# Altium schematic sheet Regulators.SchDoc
size A4
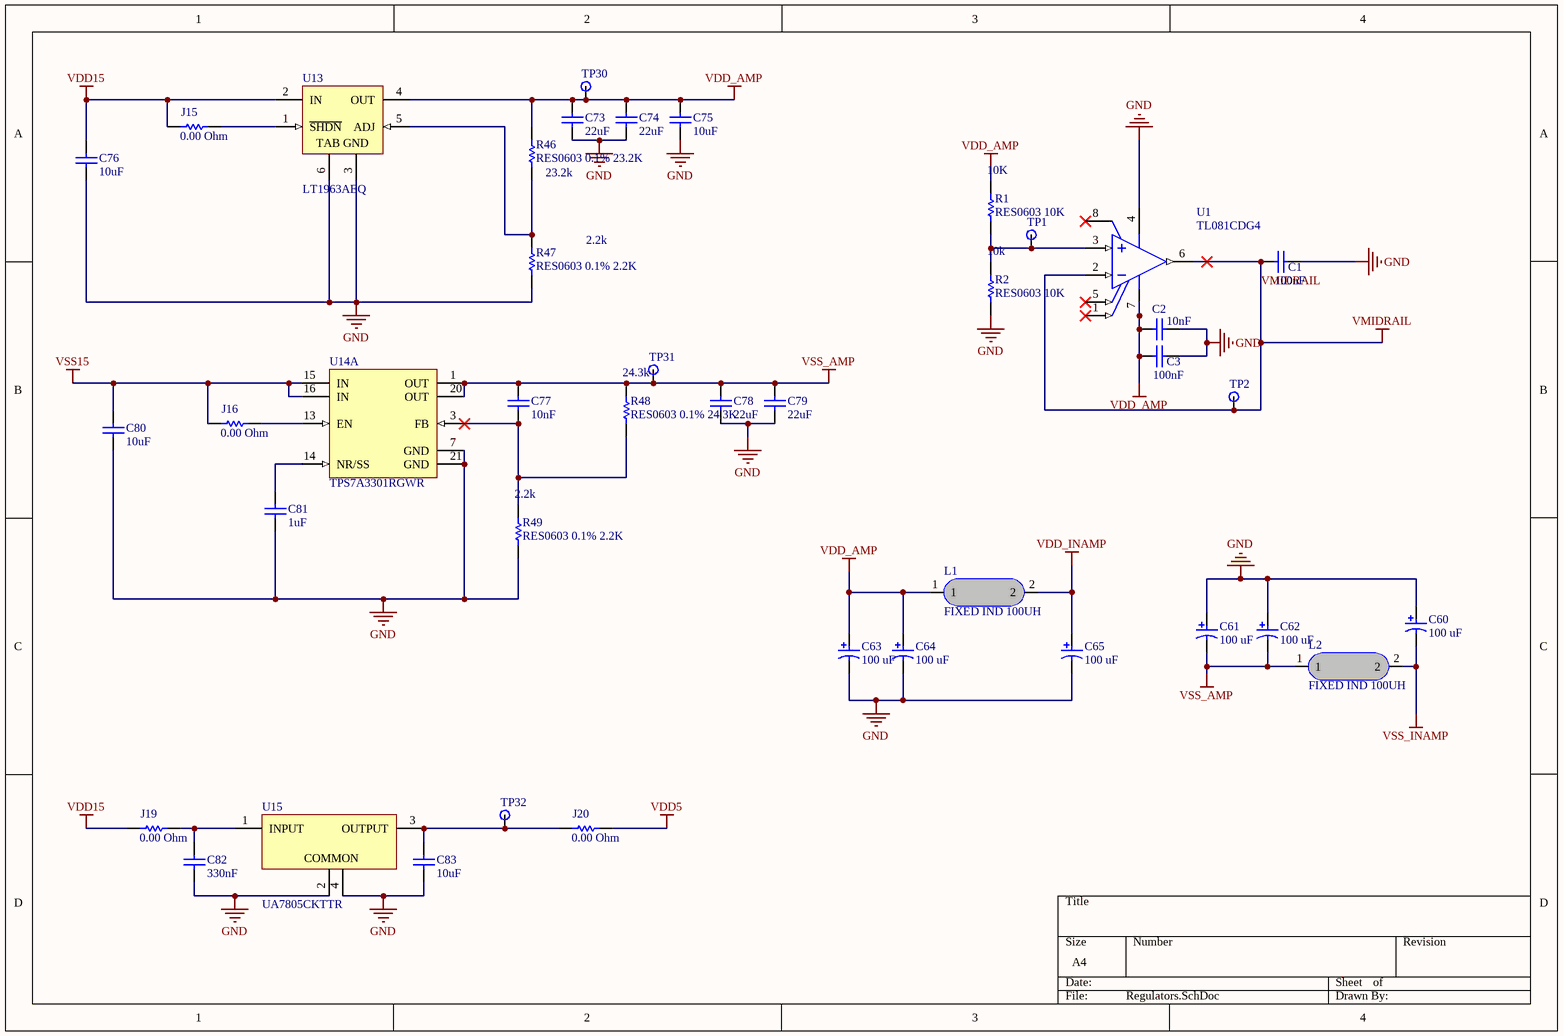
[diagram p0: Regulators.SchDoc]

## Parts
C1  value 100nF  [CAPC0603(1608)100_M]  (hidden comment: CAP 100nF 25V 0603(1608))
C2  value 10nF  [CAPC0603(1608)100_N]  (hidden comment: CAP 10nF 25V 0603(1608))
C3  value 100nF  [CAPC0603(1608)100_M]  (hidden comment: CAP 100nF 25V 0603(1608))
C60  100 uF  [CAPPR55-250-1120X630X1220]
C61  100 uF  [CAPPR55-250-1120X630X1220]
C62  100 uF  [CAPPR55-250-1120X630X1220]
C63  100 uF  [CAPPR55-250-1120X630X1220]
C64  100 uF  [CAPPR55-250-1120X630X1220]
C65  100 uF  [CAPPR55-250-1120X630X1220]
C73  value 22uF  [CAPC1206(3216)190_M]  (hidden comment: CAP 22uF 25V 1206(3216))
C74  value 22uF  [CAPC1206(3216)190_M]  (hidden comment: CAP 22uF 25V 1206(3216))
C75  value 10uF  [CAPC1206(3216)190_L]  (hidden comment: CAP 10uF 25V 1206(3216))
C76  value 10uF  [CAPC1206(3216)190_L]  (hidden comment: CAP 10uF 25V 1206(3216))
C77  value 10nF  [CAPC0603(1608)100_N]  (hidden comment: CAP 10nF 25V 0603(1608))
C78  value 22uF  [CAPC1206(3216)190_M]  (hidden comment: CAP 22uF 25V 1206(3216))
C79  value 22uF  [CAPC1206(3216)190_M]  (hidden comment: CAP 22uF 25V 1206(3216))
C80  value 10uF  [CAPC1206(3216)190_L]  (hidden comment: CAP 10uF 25V 1206(3216))
C81  value 1uF  [CAPC0603(1608)100_L]  (hidden comment: CAP 1uF 25V 0603(1608))
C82  value 330nF  [CAPC0603(1608)100_L]  (hidden comment: CAP 330nF 25V 0603(1608))
C83  value 10uF  [CAPC1206(3216)190_L]  (hidden comment: CAP 10uF 25V 1206(3216))
J15  0.00 Ohm  [RESC1206(3216)_M]
J16  0.00 Ohm  [RESC1206(3216)_M]
J19  0.00 Ohm  [RESC1206(3216)_M]
J20  0.00 Ohm  [RESC1206(3216)_M]
L1  FIXED IND 100UH  [FIXED IND 100UH 520MA 850 MOHM]
L2  FIXED IND 100UH  [FIXED IND 100UH 520MA 850 MOHM]
R1  RES0603 10K  value 10K  [RESC0603(1608)_L]
R2  RES0603 10K  value 10k  [RESC0603(1608)_L]
R46  RES0603 0.1% 23.2K  value 23.2k  [RESC0603(1608)_L]
R47  RES0603 0.1% 2.2K  value 2.2k  [RESC0603(1608)_L]
R48  RES0603 0.1% 24.3K  value 24.3k  [RESC0603(1608)_L]
R49  RES0603 0.1% 2.2K  value 2.2k  [RESC0603(1608)_L]
TP1  Testpoint  [0603 PROBE PAD]  (value not drawn)
TP2  Testpoint  [0603 PROBE PAD]  (value not drawn)
TP30  Testpoint  [0603 PROBE PAD]  (value not drawn)
TP31  Testpoint  [0603 PROBE PAD]  (value not drawn)
TP32  Testpoint  [0603 PROBE PAD]  (value not drawn)
U1  TL081CDG4  [TI-D8_N]
U13  LT1963AEQ  [LT-Q-5_M]
U14  TPS7A3301RGWR  [RGW0020A_V]  (part A of 2)
U15  UA7805CKTTR  [KTT0003A_V]

## Nets
GND: C1.1 C2.2 C3.1 C60.1 C61.1 C62.1 C63.2 C64.2 C65.2 C73.2 C74.2 C75.2 C76.2 C78.2 C79.2 C80.2 C81.1 C82.1 C83.2 R2.1 R47.1 R49.1 U1.4(VCC-) U13.3(GND) U13.6(TAB) U14.7(GND) U14.21(GND) U15.2(COMMON) U15.4(COMMON)
VDD5: J20.2
VDD15: C76.1 J15.1 J19.1 U13.2(IN)
VDD_AMP: C2.1 C3.2 C63.1 C64.1 C73.1 C74.1 C75.1 L1.1 R1.2 R46.2 TP30.0 U1.7(VCC+) U13.4(OUT)
VDD_INAMP: C65.1 L1.2
VMIDRAIL: C1.2 TP2.0 U1.2(IN-) U1.6(OUT)
VSS15: C80.1 J16.1 U14.15(IN) U14.16(IN)
VSS_AMP: C61.2 C62.2 C77.2 C78.1 C79.1 L2.1 R48.2 TP31.0 U14.1(OUT) U14.20(OUT)
VSS_INAMP: C60.2 L2.2
NetC77_1: C77.1 R48.1 R49.2 U14.3(FB)
NetC81_2: C81.2 U14.14(NR/SS)
NetC82_2: C82.2 J19.2 U15.1(INPUT)
NetC83_1: C83.1 J20.1 TP32.0 U15.3(OUTPUT)
NetJ15_2: J15.2 U13.1(~{SHDN})
NetJ16_2: J16.2 U14.13(EN)
NetR1_1: R1.1 R2.2 TP1.0 U1.3(IN+)
NetR46_1: R46.1 R47.2 U13.5(ADJ)

Not connected (* = marked no-connect by the designer): U1 1(OFFSET_N1)* 5(OFFSET_N2)* 8(NC)*

## Library data of the parts
C1 C3 = CMP-1035-02588-1: CAP 100nF 25V ±10% 0603 (1608 Metric) Thickness 1mm SMD; Case-Metric: 1608; Case-EIA: 0603; Tolerance: Â±10%; Max Thickness: 1 mm; Technology: SMT; Rated Voltage: 25 V; OrderURL: http://www.digikey.ie/product-detail/en/yageo/CC0603KRX7R8BB104/311-1341-1-ND/2103125; Supplier 1: Digi-Key; Supplier Part Number 1: 311-1341-1-ND
C2 C77 = CMP-1035-02317-1: CAP 10nF 25V ±10% 0603 (1608 Metric) Thickness 1mm SMD; Tolerance: Â±10%; Case-Metric: 1608; Case-EIA: 0603; Max Thickness: 1 mm; Rated Voltage: 25 V; Technology: SMT; OrderURL: http://www.digikey.ie/product-detail/en/yageo/CC0603KRX7R8BB103/311-1360-1-ND/2103144; Supplier 1: Digi-Key; Supplier Part Number 1: 311-1360-1-ND
C60-C65 = CMP-1665-00015-4: Aluminum Electrolytic Capacitor (Radial Lead Type), 100 uF, 35 V, -40 to 85 degC, 2-Pin THD, RoHS, Bulk; Manufacturer: Panasonic; Voltage Rating: 35 V; PackageReference: Radial; ComponentLink2URL: http://industrial.panasonic.com/cdbs/www-data/pdf/RDF0000/ABA0000C1047.pdf; DatasheetVersion: 03/2016; REACH SVHC: No SVHC; Mounting Technology: Through Hole; ComponentLink2Description: Datasheet; Packaging: Bulk; Lead Pitch: 2.5 mm; Height: 11.2 mm; Pins: 2; RoHSCompliant: true; Mount: Through Hole; Package Quantity: 200; Min Operating Temperature: -40 degC; Max Operating Temperature: 85 degC; PackageDescription: 2-Pin Through Hole Device, Dia 6.3 mm, Body Length 11.2 mm; ComponentLink1Description: Manufacturer URL; Length: 11.2 mm; ComponentLink1URL: http://www.panasonic.com/
C73 C74 C78 C79 = CMP-1037-04995-1: CAP 22uF 25V ±20% 1206 (3216 Metric) Thickness 1.9mm SMD; Case-EIA: 1206; Tolerance: Â±20%; Case-Metric: 3216; Rated Voltage: 25 V; Technology: SMT; Max Thickness: 1.9 mm; OrderURL: http://www.digikey.ie/product-detail/en/taiyo-yuden/TMK316BBJ226ML-T/587-3246-1-ND/3660105; Supplier Part Number 1: 587-3246-1-ND; Supplier 1: Digi-Key
C75 C76 C80 C83 = CMP-1037-04979-1: CAP 10uF 25V ±10% 1206 (3216 Metric) Thickness 1.9mm SMD; Case-EIA: 1206; Tolerance: Â±10%; Case-Metric: 3216; Rated Voltage: 25 V; Technology: SMT; Max Thickness: 1.9 mm; OrderURL: http://www.digikey.ie/product-detail/en/murata-electronics-north-america/GRM319R61E106KA12D/490-5525-1-ND/2334921; Supplier 1: Digi-Key; Supplier Part Number 1: 490-5525-1-ND
C81 = CMP-1035-02740-1: CAP 1uF 25V ±10% 0603 (1608 Metric) Thickness 1mm SMD; Tolerance: Â±10%; Case-Metric: 1608; Case-EIA: 0603; Technology: SMT; Rated Voltage: 25 V; Max Thickness: 1 mm; OrderURL: http://www.digikey.ie/product-detail/en/taiyo-yuden/TMK107BJ105KA-T/587-1248-1-ND/931025; Supplier Part Number 1: 587-1248-1-ND; Supplier 1: Digi-Key
C82 = CMP-1035-02674-1: CAP 330nF 25V ±10% 0603 (1608 Metric) Thickness 1mm SMD; Tolerance: Â±10%; Case-Metric: 1608; Case-EIA: 0603; Max Thickness: 1 mm; Technology: SMT; Rated Voltage: 25 V
J15 J16 J19 J20 = CMP-1014-00001-1: Jumper 1206 (3216 Metric); Tolerance: None; Case-EIA: 1206; Case-Metric: 3216; Technology: SMT; Power: None; Value: 0.00 Ohm; OrderURL: http://www.digikey.ie/product-detail/en/yageo/RC0603JR-070RL/311-0.0GRCT-ND/729622; Supplier 1: Digi-Key; Supplier Part Number 1: 311-0.0GRCT-ND
L1 L2 = 74408943101: FIXED IND 100UH 520MA 850 MOHM; Manufacturer: Wurth Electronics Inc.; Type: Wirewound; Material - Core: Ferrite; Inductance: 100µH; Tolerance: ±20%; Current - Saturation: 680mA; Shielding: Shielded; DC Resistance (DCR): 850 mOhm Max; Frequency - Self Resonant: 7.8MHz; Frequency - Test: 100kHz; Value: 1K; Published: 8-Jun-2000; LatestRevisionDate: 29-May-2009; LatestRevisionNote: IPC-7351 Footprint Added.; PackageReference: J1-0603; Publisher: Altium Limited; PackageDescription: Chip Resistor; Manufacturer Part Number: 74408943101; RoHS: RoHS Compliant; Category: Inductors, Coils, Chokes; Packaging: Tape & Reel (TR); Part Status: Active; Current Rating: 520mA; Q @ Freq: -; Ratings: -; Operating Temperature: -40°C ~ 125°C; Mounting Type: Surface Mount; Package / Case: Nonstandard; Supplier Device Package: -; Size / Dimension: 0.189" L x 0.189" W (4.80mm x 4.80mm); Height - Seated (Max): 0.161" (4.10mm); ComponentLink1URL: http://katalog.we-online.de/pbs/datasheet/74408943101.pdf; ComponentLink1Description: http://katalog.we-online.de/pbs/datasheet/74408943101.pdf; Supplier 1: Digi-Key; Supplier Part Number 1: 732-3038-2-ND; Stock 1: 9500; Pricing 1: 500=1.84552 (EUR)
R1 R2 = CMP-1591-00001-1: 0603 (1608 Metric) Chip Resistor; Manufacturer: Yageo; Manufacturer Part Number: RT0603BRD0710KL; Case-Metric: 1608; Case-EIA: 0603; Power (Watts): 0.1W, 1/10W; Temperature Coefficient: ±25ppm/°C; PackageReference: RESC0603(1608); Supplier 1: Digi-Key; Supplier Part Number 1: YAG1236CT-ND; RoHS: RoHS Compliant; Category: Resistors; Stock 1: 62928; Pricing 1: 1=0.3, 10=0.254, 25=0.1844, 50=0.1336, 100=0.0991, 250=0.07608, 500=0.05994, 1000=0.0415 (EUR); Packaging: Cut Tape (CT); Part Status: Active; Resistance (Ohms): 10k; Composition: Thin Film; Features: Moisture Resistant; Operating Temperature: -55°C ~ 155°C; Package / Case: 0603 (1608 Metric); Supplier Device Package: 0603; Size / Dimension: 0.063" L x 0.031" W (1.60mm x 0.80mm); Height - Seated (Max): 0.022" (0.55mm); Failure Rate: -; ComponentLink1URL: http://www.yageo.com/documents/recent/PYu-RT_1-to-0.01_RoHS_L_7.pdf; ComponentLink1Description: http://www.yageo.com/documents/recent/PYu-RT_1-to-0.01_RoHS_L_7.pdf
R46 = CMP-1591-00001-1: 0603 (1608 Metric) Chip Resistor; Manufacturer: Panasonic Electronic Components; Manufacturer Part Number: ERA-3AEB2322V; Case-Metric: 1608; Case-EIA: 0603; Power (Watts): 0.1W, 1/10W; Temperature Coefficient: ±25ppm/°C; PackageReference: RESC0603(1608); Supplier 1: Digi-Key; Supplier Part Number 1: P23.2KDBCT-ND; RoHS: RoHS Compliant; Category: Resistors; Stock 1: 17441; Pricing 1: 1=0.37, 10=0.27, 25=0.196, 50=0.1422, 100=0.1054, 250=0.08088, 500=0.06372, 1000=0.04411 (EUR); Packaging: Cut Tape (CT); Part Status: Active; Resistance (Ohms): 23.2k; Composition: Thin Film; Features: Automotive AEC-Q200; Operating Temperature: -55°C ~ 155°C; Package / Case: 0603 (1608 Metric); Supplier Device Package: 0603; Size / Dimension: 0.063" L x 0.031" W (1.60mm x 0.80mm); Height - Seated (Max): 0.022" (0.55mm); Failure Rate: -; ComponentLink1URL: https://industrial.panasonic.com/cdbs/www-data/pdf/RDM0000/AOA0000C237.pdf; ComponentLink1Description: https://industrial.panasonic.com/cdbs/www-data/pdf/RDM0000/AOA0000C237.pdf
R47 R49 = CMP-1591-00001-1: 0603 (1608 Metric) Chip Resistor; Manufacturer: Panasonic Electronic Components; Manufacturer Part Number: ERA-3AEB222V; Case-Metric: 1608; Case-EIA: 0603; Power (Watts): 0.1W, 1/10W; Temperature Coefficient: ±25ppm/°C; PackageReference: RESC0603(1608); Supplier 1: Digi-Key; Supplier Part Number 1: P2.2KDBCT-ND; RoHS: RoHS Compliant; Category: Resistors; Stock 1: 91131; Pricing 1: 1=0.37, 10=0.27, 25=0.196, 50=0.1422, 100=0.1054, 250=0.08088, 500=0.06372, 1000=0.04411 (EUR); Packaging: Cut Tape (CT); Part Status: Active; Resistance (Ohms): 2.2k; Composition: Thin Film; Features: Automotive AEC-Q200; Operating Temperature: -55°C ~ 155°C; Package / Case: 0603 (1608 Metric); Supplier Device Package: 0603; Size / Dimension: 0.063" L x 0.031" W (1.60mm x 0.80mm); Height - Seated (Max): 0.022" (0.55mm); Failure Rate: -; ComponentLink1URL: https://industrial.panasonic.com/cdbs/www-data/pdf/RDM0000/AOA0000C237.pdf; ComponentLink1Description: https://industrial.panasonic.com/cdbs/www-data/pdf/RDM0000/AOA0000C237.pdf
R48 = CMP-1591-00001-1: 0603 (1608 Metric) Chip Resistor; Manufacturer: Panasonic Electronic Components; Manufacturer Part Number: ERA-3AEB2432V; Case-Metric: 1608; Case-EIA: 0603; Power (Watts): 0.1W, 1/10W; Temperature Coefficient: ±25ppm/°C; PackageReference: RESC0603(1608); Supplier 1: Digi-Key; Supplier Part Number 1: P24.3KDBCT-ND; RoHS: RoHS Compliant; Category: Resistors; Stock 1: 12451; Pricing 1: 1=0.37, 10=0.27, 25=0.196, 50=0.1422, 100=0.1054, 250=0.08088, 500=0.06372, 1000=0.04411 (EUR); Packaging: Cut Tape (CT); Part Status: Active; Resistance (Ohms): 24.3k; Composition: Thin Film; Features: Automotive AEC-Q200; Operating Temperature: -55°C ~ 155°C; Package / Case: 0603 (1608 Metric); Supplier Device Package: 0603; Size / Dimension: 0.063" L x 0.031" W (1.60mm x 0.80mm); Height - Seated (Max): 0.022" (0.55mm); Failure Rate: -; ComponentLink1URL: https://industrial.panasonic.com/cdbs/www-data/pdf/RDM0000/AOA0000C237.pdf; ComponentLink1Description: https://industrial.panasonic.com/cdbs/www-data/pdf/RDM0000/AOA0000C237.pdf
TP1 TP2 TP30-TP32 = Testpoint: 0.063" x 0.031" x 0.045" (1.60mm x 0.80mm x 1.15mm); OrderURL: http://www.digikey.ie/product-detail/en/te-connectivity-amp-connectors/RCU-0C/A106145CT-ND/3477802; Value: *; Width: 0.8; Height: 1.15mm; Length: 1.60mm; Supplier Part Number 1: A106145CT-ND; Supplier 1: Digi-Key
U1 = CMP-0017-00506-1: JFET-Input Operational Amplifier, 7 to 36 V, 0 to 70 degC, 8-pin SOIC (D8), Green (RoHS & no Sb/Br); Manufacturer: Texas Instruments; Manufacturer Part Number: TL081CDR; Total Supply Voltage(Min)(+5V is 5, +/-5V is 10): 7; Rating: Military; CMRR(Min)(dB): 70; IIB(Max)(pA): 400; Iq per channel(Max)(mA): 2.8; Vio (25C)(Max)(mV): 15; Vn at 1kHz(Typ)(nV/rtHz): 18; Slew Rate(Typ)(V/us): 13; Sub Family: General Purpose Amplifier, High Supply Voltage Amplifier (>=30V); Total Supply Voltage(Max)(+5V is 5, +/-5V is 10): 36; Number of Channels: 1; GBW(Typ)(MHz): 3; Amplifier Type: J-FET; Slew Rate: 13 V/µs; Gain Bandwidth Product: 3MHz; Current - Input Bias: 30pA; Voltage - Input Offset: 3mV; Current - Supply: 1.4mA; Voltage - Supply, Single/Dual (±): 7 V ~ 36 V, ±3.5 V ~ 18 V; ComponentLink3Description: Package Specification; Eco-Plan: Green (RoHS & no Sb/Br); PackageReference: D8; ComponentLink1Description: Manufacturer URL; PackageDescription: 8-Pin Plastic Small Outline, Body 4.9 x 3.9 mm, Pitch 1.27 mm; DatasheetVersion: SLOS081G; PackageVersion: 4040047-3/M, 06/2011; Code_JEDEC: MS-012; ComponentLink2URL: http://www.ti.com/lit/ds/symlink/tl081.pdf; ComponentLink1URL: http://www.ti.com/; Offset Drift(Typ)(uV/C): 18; Mounting Technology: Surface Mount; ComponentLink2Description: Datasheet; PartNumber: TL081CDG4; ComponentLink3URL: http://www.ti.com/litv/pdf/msoi002j; OrderURL: http://www.digikey.ie/product-detail/en/texas-instruments/TL081CDR/296-15001-1-ND/562657; Supplier 1: Digi-Key; RoHS: RoHS Compliant; Category: Integrated Circuits (ICs); Stock 1: 9909; Pricing 1: 1=0.44, 10=0.375, 100=0.28, 500=0.22002, 1000=0.17001 (EUR); Packaging: Cut Tape (CT); Part Status: Active; Number of Circuits: 1; Output Type: -; -3db Bandwidth: -; Current - Output / Channel: -; Operating Temperature: 0°C ~ 70°C; Mounting Type: Surface Mount; Package / Case: 8-SOIC (0.154", 3.90mm Width); Supplier Device Package: 8-SOIC; ComponentLink4URL: http://www.ti.com/lit/ds/symlink/tl081a.pdf; ComponentLink4Description: http://www.ti.com/lit/ds/symlink/tl081a.pdf
U13 = CMP-0476-01172-1: 1.5 A, Low Noise, Fast Transient Response LDO Regulator, 2.1 to 20 V Vin, Adjustable Vout, 5-pin DPAK (Q-5), -40 to 125 degC; Manufacturer: Linear Technology; Iout(mA): 1500; Isupply(mA): 1; Noise(uV): 40; Vin Max(V): 20; Shutdown Current(uA): 0.01; Discrete Pass Element: no; Output Voltage: Adj; Vin Min(V): 2.1; Dropout Voltage(V): 0.34; Vout Min(V): 1.21; PSRR(dB): 63; PackageReference: Q-5; Number of Outputs: 1; ComponentLink2URL: http://cds.linear.com/docs/en/datasheet/1963afe.pdf; ComponentLink2Description: Datasheet; Mounting Technology: Surface Mount; DatasheetVersion: Rev. E; ComponentLink3URL: http://cds.linear.com/docs/en/packaging/Q%20DD5%2005-08-1461%20Rev%20F.pdf; ComponentLink1Description: Manufacturer URL; PackageDescription: 5-Pin Plastic DD Pak, Body 10.2235 x 8.89 mm, Pitch 1.702 mm; ComponentLink3Description: Package Specification; Vout Max(V): 20; ComponentLink1URL: http://www.linear.com/; PackageVersion: Rev. F, 09/2011; RoHS: FALSE; PartNumber: LT1963AEQ
U14 = CMP-0395-01391-2: Single Output High PSRR LDO, 1 A, Adjustable -1.18 to -33 V Output, -3 to -36 V Input, with Ultra-Low Noise, 20-pin VQFN (RGW), -40 to 125 degC, Green (RoHS & no Sb/Br); Manufacturer: Texas Instruments; SubFamily: Single Channel LDO; Vdo(Typ)(mV): 290; Iq(Typ)(mA): 0.21; Iout(Max)(A): 1; Accuracy(%): 1.5; PackageDescription: 20-Pin Plastic Quad Flat No-Pin, 5 x 5 mm Body, 0.65 mm Pitch, 3.15 x 3.15 mm Exposed Pad; DatasheetVersion: SBVS169B; ComponentLink1Description: Manufacturer URL; ComponentLink2Description: Datasheet; PartNumber: TPS7A3301RGWR; Eco-Plan: Green (RoHS & no Sb/Br); Vin(Min)(V): -3; ComponentLink2URL: http://www.ti.com/general/docs/lit/getliterature.tsp?genericPartNumber=TPS7A3301&fileType=pdf; ComponentLink3Description: Package Specification; PackageReference: RGW0020A; Vout Adj(Max)(V): -33; Vin(Max)(V): -36; Vout Adj(Min)(V): -1.18; ComponentLink1URL: http://www.ti.com/; Code_JEDEC: MO-220; ComponentLink3URL: http://www.ti.com/litv/pdf/mpqf122b; Mounting Technology: Surface Mount
U15 = CMP-1685-00014-1: Fixed Positive Voltage Regulator, 7 to 25 V, 1.5 A, 0 to 125 degC, 3-Pin DDPAK (KTT), Green (RoHS / & no Sb/Br), Tape and Reel; Tolerance: 1%; Resistance: 220 Ohm; Case\Package: 0603; Voltage Rating: 50 V; Power Rating: 100 mW; Package Quantity: 5000; Min Operating Temperature: -55 degC; ComponentLink2Description: Datasheet; ComponentLink1Description: Manufacturer URL; RoHSCompliant: true; Mount: Surface Mount; PackageDescription: 3-Pin Surface Mount Device, Body 10.16 x 9.015 mm, Pitch 2.54 mm; Width: 0.8 mm; Max Operating Temperature: 155 degC; Pins: 2; ComponentLink1URL: http://www.ti.com/; Case Code (Metric): 1608; Packaging: Tape and Reel; Case Code (Imperial): 0603; Height: 0.45 mm; Code_JEDEC: TO-263; DatasheetVersion: SLVS056P, 01/2015; Length: 1.6 mm; REACH SVHC: No SVHC; ComponentLink2URL: http://www.ti.com/lit/ds/symlink/ua7805.pdf; PackageReference: KTT0003A; Voltage Rating (DC): 50 V